# Altium schematic sheet Power_Tree.SchDoc
size A; SheetNumber: 3; SheetTotal: 5
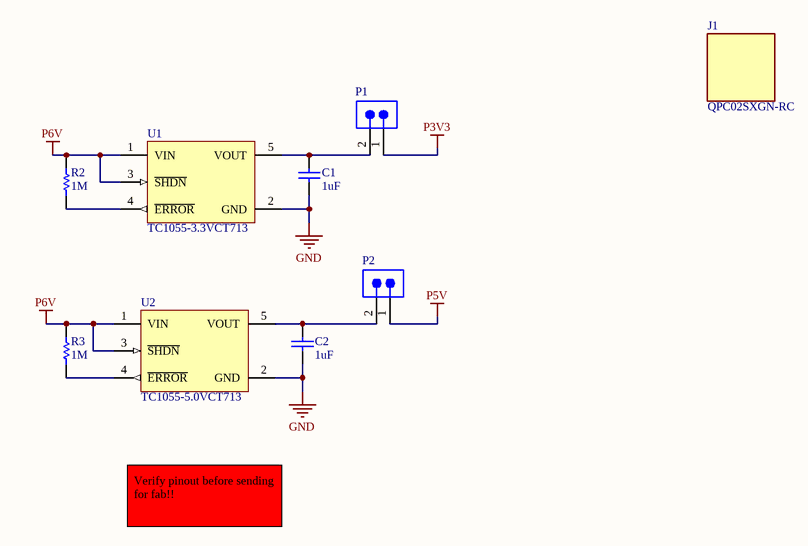
[diagram p0: Power_Tree.SchDoc]

## Parts
C1  value 1uF  [FOOTPRINT-1206-GEN]  (hidden comment: 1206 1uF)
C2  value 1uF  [FOOTPRINT-1206-GEN]  (hidden comment: 1206 1uF)
J1  QPC02SXGN-RC  [FP-QPC02SXGN-RC-MFG]
P1  TSW-102-26-F-S  [SMTC-TSW-102-26-XX-S]  (value not drawn)
P2  TSW-102-26-F-S  [SMTC-TSW-102-26-XX-S]  (value not drawn)
R2  1M  [RESC3116X65X50NL20T20]
R3  1M  [RESC3116X65X50NL20T20]
U1  TC1055-3.3VCT713  [SOT-23-CT5_L]
U2  TC1055-5.0VCT713  [SOT-23-CT5_N]

## Nets
GND: C1.1 C2.1 U1.2(GND) U2.2(GND)
P3V3: P1.1
P5V: P2.1
P6V: R2.2 R3.2 U1.1(VIN) U1.3(~{SHDN}) U2.1(VIN) U2.3(~{SHDN})
NetC1_2: C1.2 P1.2 U1.5(VOUT)
NetC2_2: C2.2 P2.2 U2.5(VOUT)
NetR2_1: R2.1 U1.4(~{ERROR})
NetR3_1: R3.1 U2.4(~{ERROR})

## Notes on the sheet
- Verify pinout before sending for fab!!

## Library data of the parts
C1 C2 = CMP-001-00085-2: CAP CER 1UF 50V X7R 1206 ±10% 50V Ceramic Capacitor X7R 1206 (3216 Metric); Part Number: 1276-6781-1-ND; Published: 8-Jun-2000; LatestRevisionNote: Re-released for DXP Platform.; PackageReference: RAD-0.3; Publisher: Altium Limited; PackageDescription: Radial Cap, Thru-Hole; 2 Leads; 0.3 in Pin Spacing; Design Item ID: Capacitor-Generic-1206; Source: Generic.SchLib; Type: Capacitor
J1 = CMP-25666-000001-1: CONN JUMPER SHORTING .100" GOLD; Manufacturer: Sullins; Conn Orientation: Straight; Pitch: 2.54mm; Current Rating: 3A; Number Of Contacts: 2; Category: Conn; Temperature Range Low: -40°C; Temperature Range High: +85°C; Device Class L1: Connectors; Lead Free: Yes; Manufacturer Part Number: QPC02SXGN-RC; Automotive: No; Height: 6.17mm; ComponentLink2URL: https://s3.amazonaws.com/catalogspreads-pdf/PAGE128-129%20.100%20JUMPER.pdf; Device Class L2: unset; Footprint Url: https://drawings-pdf.s3.amazonaws.com/11510.pdf; Device Class L3: unset; Temperature: -40°C to +85°C; RoHS: TRUE; Digikey Description: CONN JUMPER SHORTING .100" GOLD; Octopart: https://octopart.com/qpc02sxgn-rc-sullins-19878795; Package: 0; ComponentLink2Description: Datasheet; Contact Material: Gold
P1 P2 = CMP-002-00072-1: Headers & Wire Housings Classic PCB Header Strips, 0.100 pitch; Number of Positions: 2; Max Voltage Rating (AC): 550V; Gender: Male; Pitch: 2.54mm; Contact Post Length: 3.2mm; Voltage Rating: 500V; Max Current Rating: 7.6A; Contact Material: Bronze; Contact Gender: Male; Contact Type: -; REACH SVHC: No SVHC; Min Operating Temperature: -55°C; Housing Material: Polyester; Packaging: Bulk; Termination: Through Hole; Max Operating Temperature: 125°C; Orientation: Vertical; Flammability Rating: UL94 V-0; Package Quantity: 1; Depth: 2.54mm; Contact Plating: Gold; Number of Rows: 1; Radiation Hardening: No; Number of Contacts: 2; Length: 5.08mm; RoHS Compliant: Yes; Housing Color: Black; Weight: 0.001257oz; Contact Mating Length: 5.84mm; Series: TSW
R2 R3 = CMP-2003-04887-1: CRCW12061M00FKEAHP / 1M 1206; Manufacturer: Vishay Dale; Part Number: CRCW12061M00FKEAHP
U1 = CMP-0136-00572-1: 50 mA, 100 mA and 150 mA CMOS LDOs with Shutdown and Active-Low Error Output, 5-Pin SOT-23, Extended Temperature, Tape and Reel; PackageVersion: revBB, Aug-2009; PackageDescription: 5-Lead Plastic Small Outline Transistor (CT) [SOT-23]; PackageReference: SOT-23-CT5; Code_IPC: SOT23-5; DatasheetVersion: revD, Feb-2007
U2 = CMP-0136-00550-1: 50 mA, 100 mA and 150 mA CMOS LDOs with Shutdown and Active-Low Error Output, 5-Pin SOT-23, Extended Temperature, Tape and Reel; PackageReference: SOT-23-CT5; PackageDescription: 5-Lead Plastic Small Outline Transistor (CT) [SOT-23]; Code_IPC: SOT23-5; DatasheetVersion: revD, Feb-2007; PackageVersion: revBB, Aug-2009